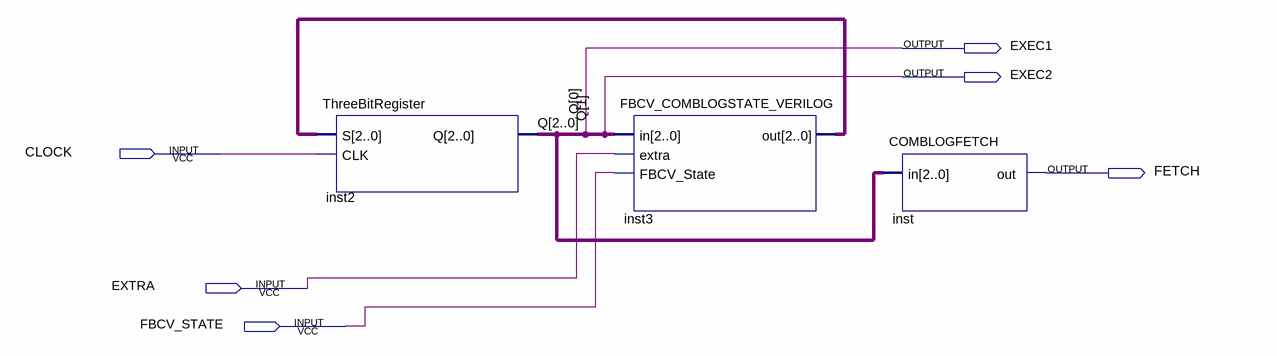
[diagram p0: schematic sheet]
// Quartus schematic FBCV_Project_StateMachine_V1.bdf as structural Verilog: 3 symbols, 6 pins
module FBCV_Project_StateMachine_V1 (
  input  CLOCK,
  input  EXTRA,
  input  FBCV_STATE,
  output EXEC1,
  output EXEC2,
  output FETCH
);

  wire [2:0] inst3_out;
  wire [2:2] Q;

  ThreeBitRegister inst2 (.S(inst3_out), .CLK(CLOCK), .Q({Q[2], EXEC2, EXEC1}));
  FBCV_COMBLOGSTATE_VERILOG inst3 (.in({Q[2], EXEC2, EXEC1}), .extra(EXTRA), .FBCV_State(FBCV_STATE), .out(inst3_out));
  COMBLOGFETCH inst (.in({Q[2], EXEC2, EXEC1}), .out(FETCH));

  // Other names for the same wires on the sheet: Q[1:0] = {EXEC2, EXEC1}
endmodule
